# EAGLE design WT8266_universal_v01 (EAGLE 9.6.2)
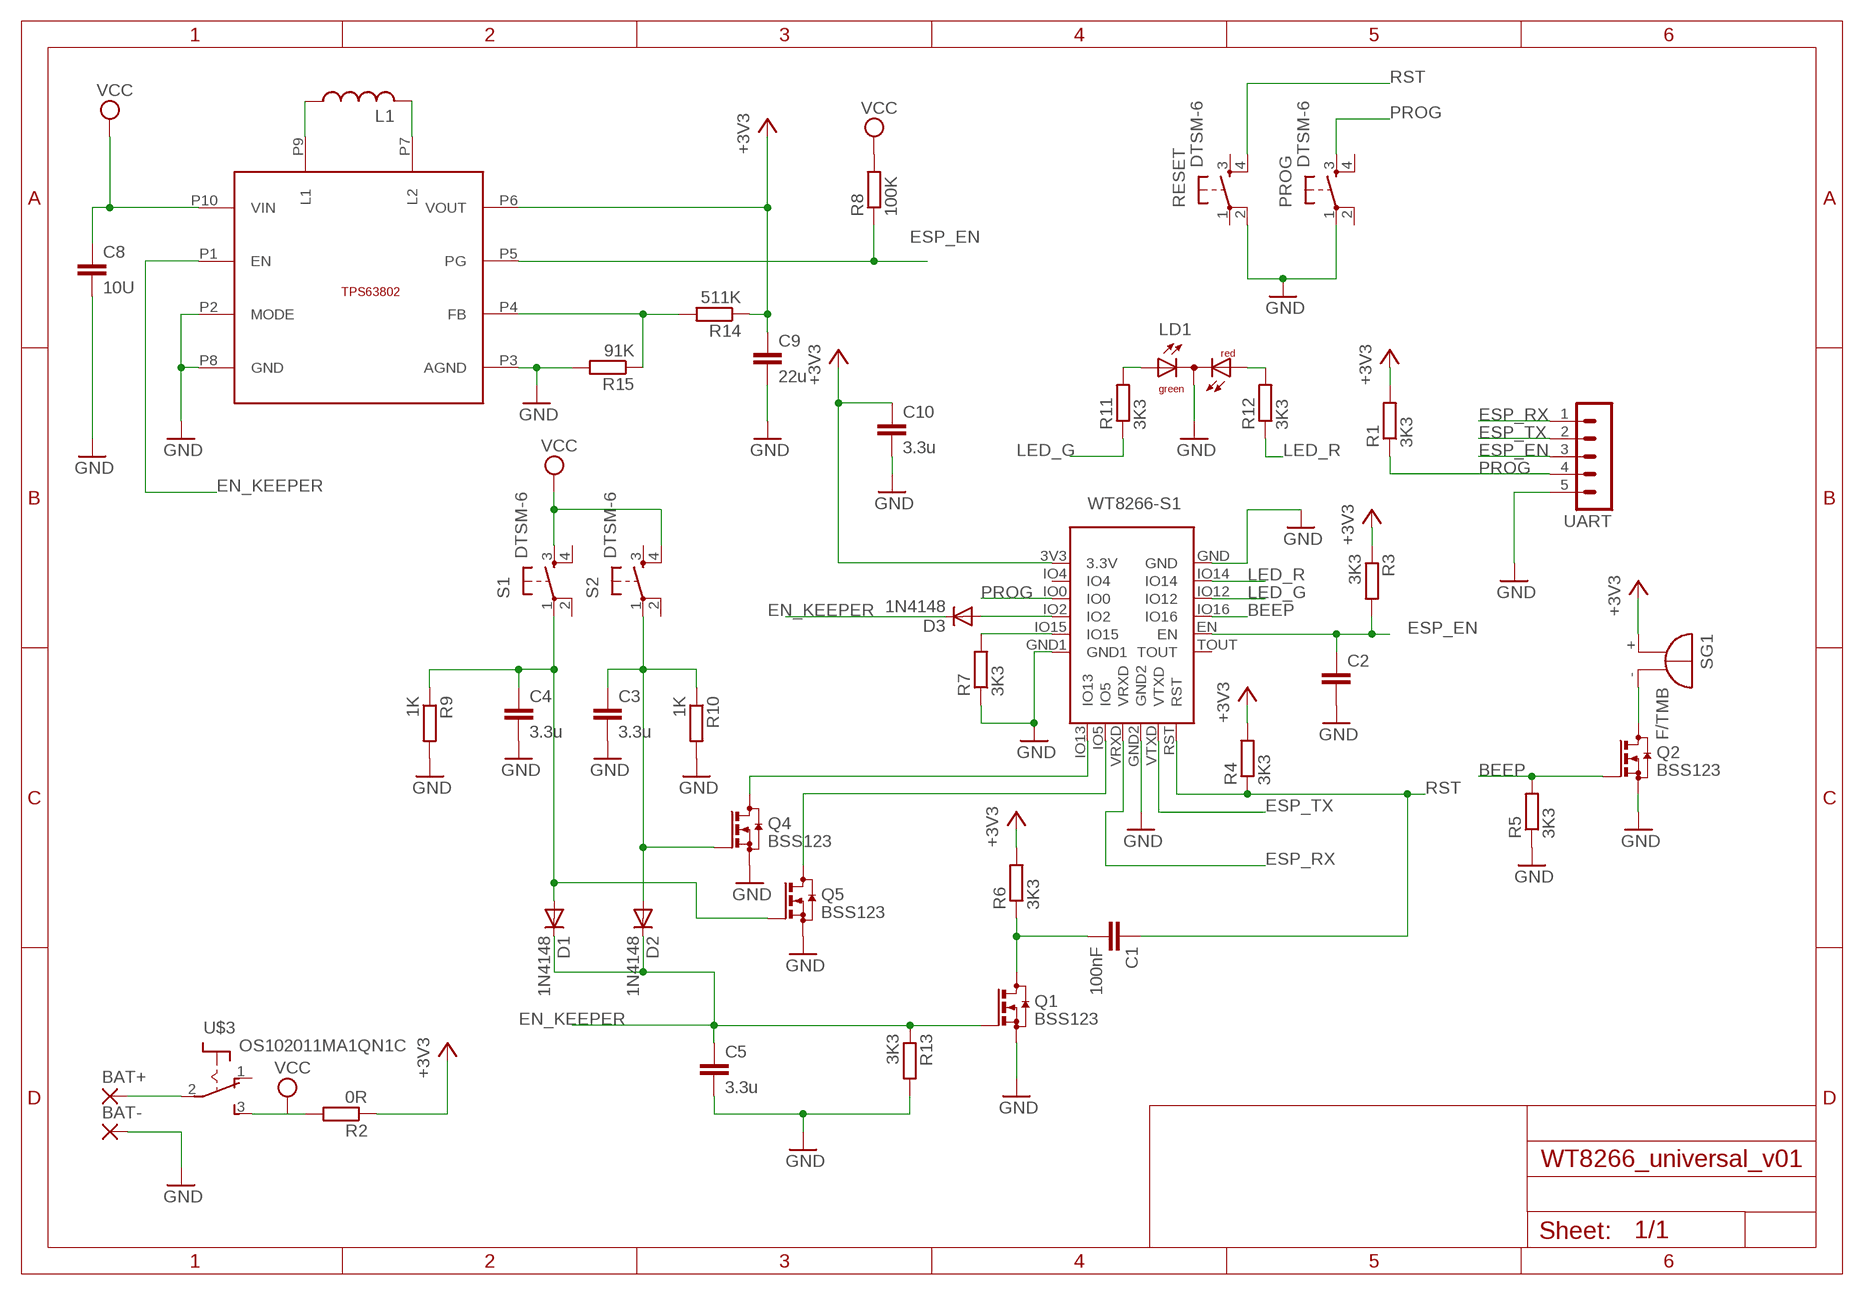
[diagram p0: schematic, sheet 1]

## Parts
BAT+  2,54/1,0  [2,54/1,0]
BAT-  2,54/1,0  [2,54/1,0]
C1  100nF  C-EUC0805  [C0805]
C2  C-EUC0805  [C0805]
C3  3.3u  C-EUC0805  [C0805]
C4  3.3u  C-EUC0805  [C0805]
C5  3.3u  C-EUC0805  [C0805]
C8  10U  C-EUC0805  [C0805]
C9  22u  C-EUC0805  [C0805]
C10  3.3u  C-EUC0805  [C0805]
D1  1N4148  [0805]
D2  1N4148  [0805]
D3  1N4148  [0805]
L1  L-USL2825P  [L2825P]
LD1  DUOLED-RG-C3MM  [DUOLED-A-3MM]
PROG  DTSM-6  [DTSM-6]
Q1  BSS123  [SOT23]
Q2  BSS123  [SOT23]
Q4  BSS123  [SOT23]
Q5  BSS123  [SOT23]
R1  3K3  R-EU_R0805  [R0805]
R2  0R  R-EU_R0805  [R0805]
R3  3K3  R-EU_R0805  [R0805]
R4  3K3  R-EU_R0805  [R0805]
R5  3K3  R-EU_R0805  [R0805]
R6  3K3  R-EU_R0805  [R0805]
R7  3K3  R-EU_R0805  [R0805]
R8  100K  R-EU_R0805  [R0805]
R9  1K  R-EU_R0805  [R0805]
R10  1K  R-EU_R0805  [R0805]
R11  3K3  R-EU_R0805  [R0805]
R12  3K3  R-EU_R0805  [R0805]
R13  3K3  R-EU_R0805  [R0805]
R14  511K  R-EU_R0805  [R0805]
R15  91K  R-EU_R0805  [R0805]
RESET  DTSM-6  [DTSM-6]
S1  DTSM-6  [DTSM-6]
S2  DTSM-6  [DTSM-6]
SG1  F/TMB  [F/TMB]
U$1  WT8266-S1  [WT8266-S1]
U$3  OS102011MA1QN1C  [OS102011MA1QN1C]
U$4  TPS63802  [VSON-HR-10]
UART  MAR05-1  [MAR05-1]

## Nets
+3V3: C9.1 C10.1 R1.2 R2.1 R3.1 R4.2 R6.2 R14.1 SG1.+ U$1.3V3(3.3V) U$4.P6(VOUT)
BEEP: Q2.1(G) R5.2 U$1.IO16
EN_KEEPER: C5.1 D1.1(C) D2.1(C) D3.1(C) Q1.1(G) R13.1 U$4.P1(EN)
ESP_EN: C2.1 R3.2 R8.1 U$1.EN U$4.P5(PG) UART.3
ESP_RX: U$1.VRXD UART.1
ESP_TX: U$1.VTXD UART.2
GND: BAT-.1(P) C2.2 C3.2 C4.2 C5.2 C8.2 C9.2 C10.2 LD1.2(C) PROG.1 Q1.2(S) Q2.2(S) Q4.2(S) Q5.2(S) R5.1 R7.1 R9.2 R10.2 R13.2 R15.2 RESET.2 U$1.GND U$1.GND1 U$1.GND2 U$4.P2(MODE) U$4.P3(AGND) U$4.P8(GND) UART.5
LED_G: R11.1 U$1.IO12
LED_R: R12.1 U$1.IO14
N$1: R14.2 R15.1 U$4.P4(FB)
N$2: C1.2 Q1.3(D) R6.1
N$3: R7.2 U$1.IO15
N$4: D3.2(A) U$1.IO2
N$5: Q4.3(D) U$1.IO13
N$6: Q5.3(D) U$1.IO5
N$7: LD1.1(AG) R11.2
N$8: Q2.3(D) SG1.-
N$9: BAT+.1(P) U$3.2(P)
N$10: C3.1 D2.2(A) Q4.1(G) R10.1 S2.1
N$11: L1.1 U$4.P9(L1)
N$12: C4.1 D1.2(A) Q5.1(G) R9.1 S1.1
N$13: L1.2 U$4.P7(L2)
N$14: LD1.3(AR) R12.2
PROG: PROG.3 R1.1 U$1.IO0 UART.4
RST: C1.1 R4.1 RESET.4 U$1.RST
VCC: C8.1 R2.2 R8.2 S1.3 S2.4 U$3.3(S) U$4.P10(VIN)
Unconnected: PROG.2 PROG.4 RESET.1 RESET.3 S1.2 S1.4 S2.2 S2.3 U$1.IO4 U$1.TOUT U$3.1(O)

## Library data of the parts
BAT+ BAT- = wirepad:2,54/1,0: THROUGH-HOLE PAD
C1-C5 C8-C10 = rcl:C-EU: CAPACITOR, European symbol
D1-D3 = diode:1N4148: DIODE high speed (Philips)
L1 = rcl:L-US: INDUCTOR, American symbol
LD1 = led:DUOLED-RG-C: DUO LED 2 colors (red/green), 5 mm, round, common Cathode www.ligitek.com or other producers.
PROG RESET S1 S2 = switch-tact:DTSM-6
Q1 Q2 Q4 Q5 = transistor-small-signal:BSS123: N-CHANNEL MOS FET
R1-R15 = rcl:R-EU_: RESISTOR, European symbol
SG1 = buzzer:F/TMB: BUZZER Source: Buerklin; OC_FARNELL: unknown; OC_NEWARK: unknown
U$1 = espressif:WT8266-S1
U$3 = switch:OS102011MA1QN1C
U$4 = texas:TPS63802
UART = con-lstb:MAR05-1: PIN HEADER; OC_FARNELL: unknown; OC_NEWARK: unknown

## Board
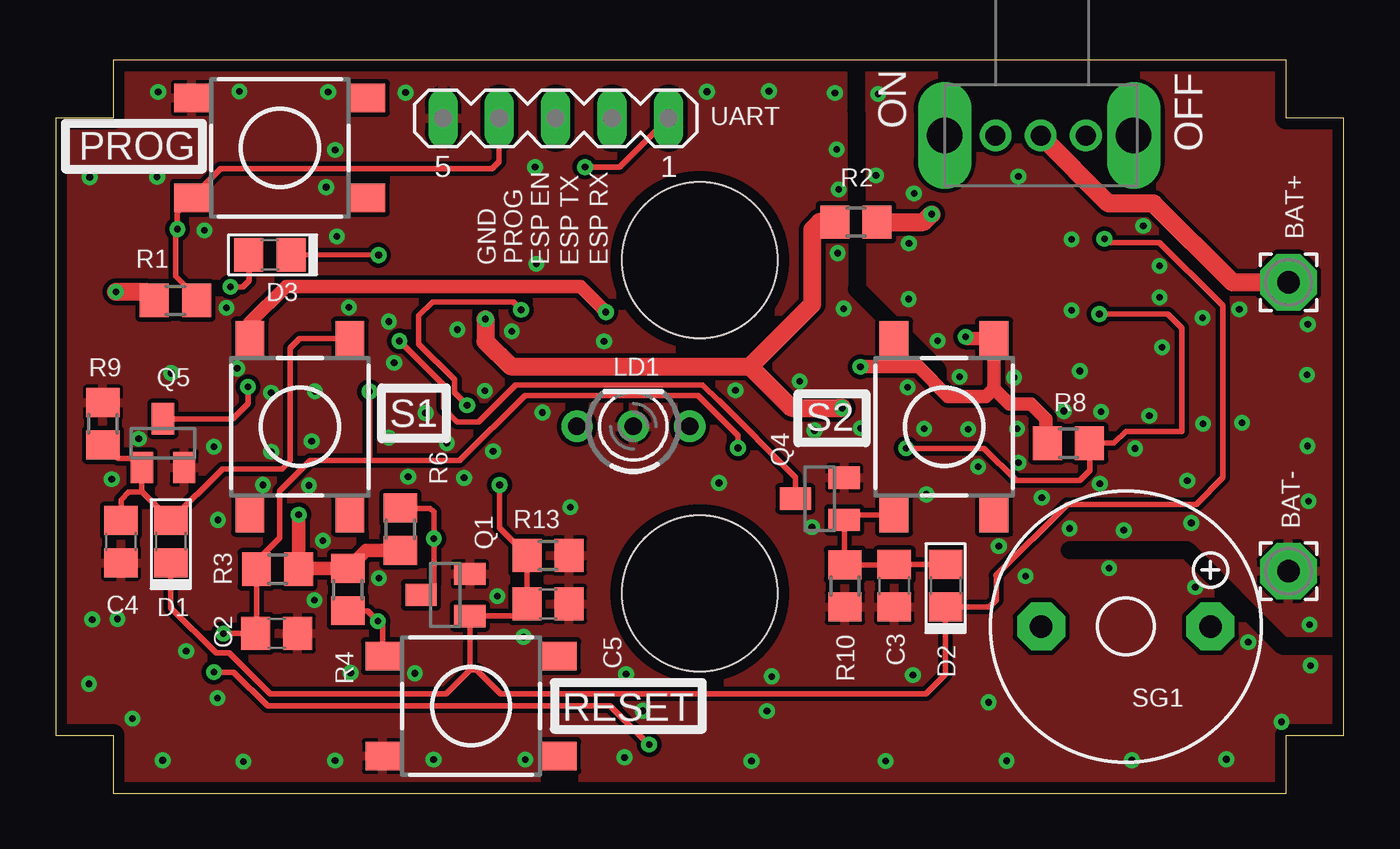
[diagram p1: board, top side]
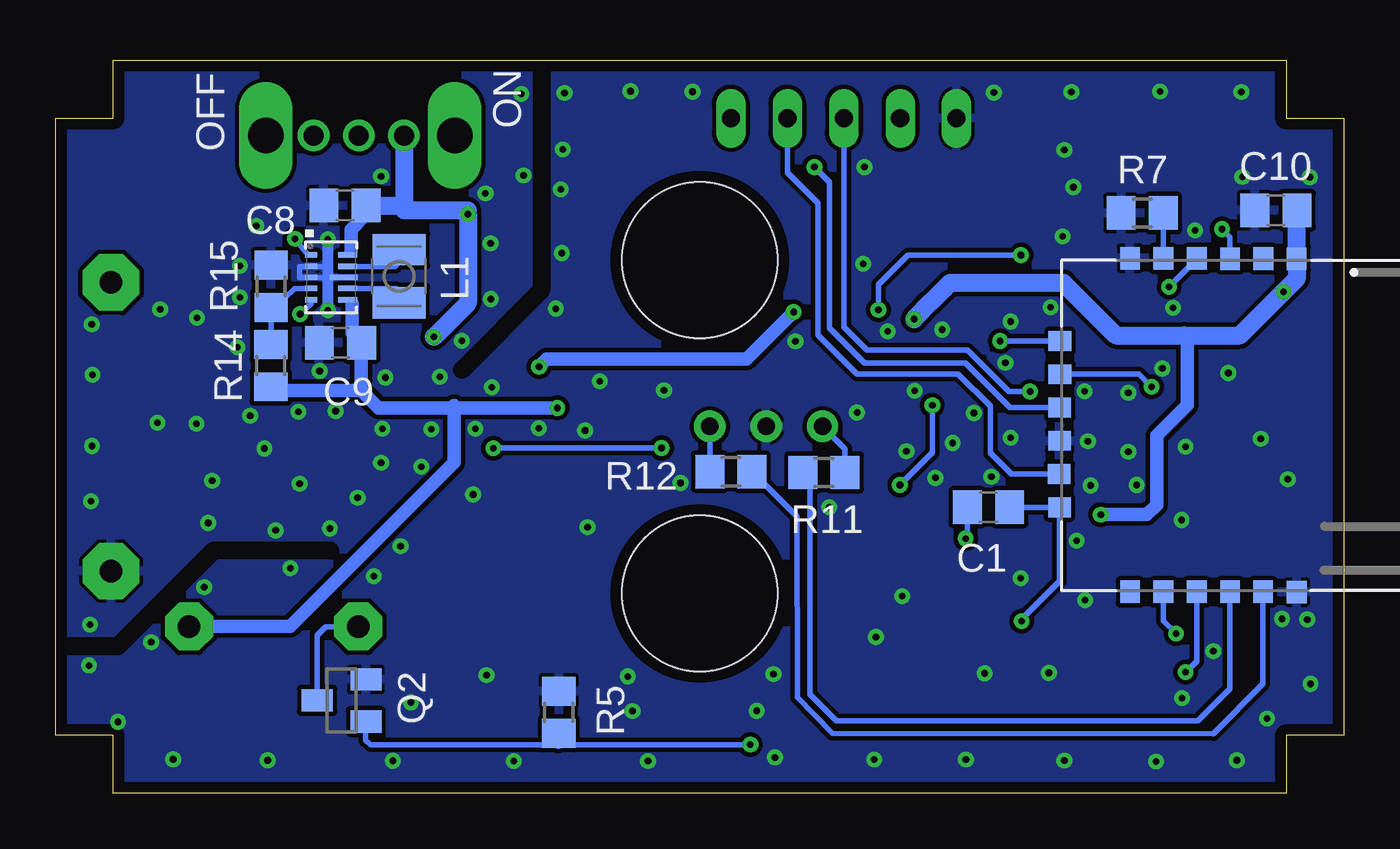
[diagram p2: board, bottom side, seen from below]

Size 58 x 33 mm. Coordinates in mm from the lower left corner, seen from the top.
Outline: 2.6,0 55.4,0 55.4,2.6 58,2.6 58,30.39 55.4,30.39 55.4,33 2.6,33 2.6,30.39 0,30.39 0,2.6 2.6,2.6 2.6,0
Copper layers (1*16): Top 0.035mm / dielectric 1.5mm / Bottom 0.035mm
Design rules "default *": minimum track width 6mil, minimum drill 0.3mm, track to track 6mil, track to pad 6mil, pad to pad 6mil, via to via 6mil, smd to smd 6mil, copper to edge 20mil, drill to drill 10mil, minimum pad ring 10mil, minimum via ring 8mil, stop-mask expansion 2mil, vias tented up to drill 12mil, thermal gap 6mil
Holes 7 mm at 29,9 29,24
tRestrict: 5 lines
bRestrict: 5 lines

### Footprints (pad centres in the part's own frame; a part is rotated, then mirrored left to right if it is on the bottom)
2,54/1,0 = drill 1.016 pad 2.54 octagon: 1 0,0
C0805 = smd 1.3 x 1.5: 1 -0.95,0; 2 0.95,0
0805 = smd 1.3 x 1.5: 1 -0.95,0; 2 0.95,0
L2825P = smd 1.4 x 2.4: 1 -1.2,0; 2 1.2,0
DUOLED-A-3MM = drill 0.8 pad 1.4: 1 -2.54,0; 2 0,0; 3 2.54,0
DTSM-6 = smd 1.55 x 1.3: 1 -3.975,2.25; 2 3.975,2.25; 3 -3.975,-2.25; 4 3.975,-2.25
SOT23 = smd 1 x 1.4: 1 -0.95,-1.1; 2 0.95,-1.1; 3 0,1.1
R0805 = smd 1.3 x 1.5: 1 -0.95,0; 2 0.95,0
F/TMB = drill 1.016 pad 2.159 octagon: + 3.81,0; - -3.81,0
WT8266-S1 = smd 1.016 x 0.889: 3V3 -7.62,1.753; EN 7.379,-4.248; GND 7.385,1.759; GND1 -7.639,-5.747; IO0 -7.62,-1.245; IO2 -7.633,-2.737; IO4 -7.626,0.26; IO12 7.379,-1.245; IO14 7.379,0.241; IO15 -7.633,-4.248; IO16 7.379,-2.743; TOUT 7.372,-5.74 | smd 0.889 x 1.016: GND2 0.578,-8.915; IO5 -2.419,-8.903; IO13 -3.918,-8.903; RST 3.581,-8.922; VRXD -0.921,-8.909; VTXD 2.076,-8.928
OS102011MA1QN1C = drill 0.9 pad 1.422: 1 -2.032,0; 2 0,0; 3 2.032,0 | drill 1.6 pad 2.184 long: P$1 -4.191,0; P$2 4.318,0
VSON-HR-10 = smd 0.6 x 0.25: P1 -0.902,1.003; P2 -0.902,0.495; P3 -0.902,0; P4 -0.902,-0.495; P5 -0.902,-1.003 | smd 0.9 x 0.25: P6 0.749,-1.003; P7 0.749,-0.495; P9 0.749,0.495; P10 0.749,1.003 | smd 1.3 x 0.25: P8 0.559,0
MAR05-1 = drill 0.813 long: 1 -5.08,0; 2 -2.54,0; 3 0,0; 4 2.54,0; 5 5.08,0

### Placement (x,y rotation side)
BAT+  55.5,23 0 top
BAT-  55.5,10 0 top
C1  16,12.88 180 bottom
C2  9.96,7.2 0 top
C3  37.76,9.35 270 top
C4  2.95,11.33 270 top
C5  22.17,8.52 0 top
C8  44.97,26.47 180 bottom
C9  45.17,20.28 180 bottom
C10  3.06,26.25 180 bottom
D1  5.19,11.33 90 top
D2  40.07,9.35 90 top
D3  9.65,24.24 180 top
L1  42.53,23.28 270 bottom
LD1  26.01,16.52 0 top
PROG  10.1,29.06 0 top
Q1  17.55,8.93 90 top
Q2  45.12,4.18 90 bottom
Q4  34.4,13.26 90 top
Q5  4.84,15.76 0 top
R1  5.4,22.19 180 top
R2  36.03,25.72 0 top
R3  9.99,10.08 180 top
R4  13.16,9.17 90 top
R5  35.34,3.64 270 bottom
R6  15.52,11.89 270 top
R7  9.08,26.12 0 bottom
R8  45.59,15.76 180 top
R9  2.13,16.64 90 top
R10  35.53,9.33 270 top
R11  23.41,14.44 0 bottom
R12  27.6,14.48 180 bottom
R13  22.17,10.71 0 top
R14  48.31,19.25 90 bottom
R15  48.3,22.82 90 bottom
RESET  18.71,3.92 180 top
S1  11,16.5 270 top
S2  40,16.5 90 top
SG1  48.18,7.51 0 top
U$1  3.89,16.45 270 bottom
U$3  44.35,29.62 180 top
U$4  45.59,23.23 0 bottom
UART  22.52,30.39 180 top

### Tracks (layer width: path | path; a pad name or v marks a point on that pad's centre or on a via)
+3V3  (via drill 0.3)
  Top 0.406: 35.23,17.55 v35.41,17.35
  Top 0.61: R6.2 13.97,10.94 R4.2 10.98,10.12 R3.1 v10.95,12.54 v10.95,12.55
  Top 0.813: v2.72,22.58 4.05,22.58 R1.2 | v19.36,21.35 19.36,20.34 20.5,19.21 31.27,19.21 | 31.27,19.21 33.13,17.35 v35.41,17.35 | R2.1 34.39,25.72 34.39,25.69 34.06,25.36 34.06,22.01 31.27,19.21
  Bottom 0.25: U$4.P6 44.68,22.23 44.65,22.05 | 44.23,20.27 C9.1
  Bottom 0.61: 44.65,22.05 44.65,20.71 C9.1 | 44.23,20.27 44.23,18.14 | 44.23,18.14 43.45,17.35 39.97,17.35 | R14.1 47.83,18.14 44.23,18.14 | v10.95,12.55 8.87,12.55 8.43,12.98 8.43,16.1 7.05,17.49 7.05,20.47 7.19,20.61 | SG1.+ 47.43,7.51 40.06,14.88 40.06,17.45 39.97,17.35 | v35.41,17.35 39.97,17.35
  Bottom 0.813: C10.1 2.13,26.23 U$1.3V3 2.13,23.16 v2.72,22.58 4.69,20.61 7.19,20.61 10.26,20.61 12.62,22.97 17.73,22.97 17.98,22.72 18,22.72 18.58,22.14 18.59,22.14 v19.36,21.35
BEEP  (via drill 0.3, 0.3 pad 0.3)
  Top 0.25: v26.72,2.18 24.97,3.94 9.54,3.94 8.03,5.45 v7.12,5.45
  Bottom 0.25: v26.72,2.18 35.37,2.18 43.83,2.18 44.03,2.39 Q2.1 | U$1.IO16 6.63,5.94 v7.12,5.45
  Bottom 0.406: R5.2 35.34,2.21 35.37,2.18
EN_KEEPER  (via drill 0.3)
  Top 0.25: D3.1 14.5,24.23 v14.54,24.23 | D1.1 5.19,8.34 7.23,6.31 7.81,6.31 9.66,4.47 17.58,4.47 18.66,5.55 | 18.66,5.55 Q1.1 20.68,7.98 C5.1 | v47.22,24.96 47.37,24.8 49.7,24.8 52.35,22.16 52.55,21.96 52.55,14.21 51.35,12.99 45.54,12.99 42.34,9.8 | 18.66,5.55 18.95,5.55 20.03,4.47 37.45,4.47 | v20.95,21.77 20.61,22.11 16.97,22.12 16.34,21.5 16.34,20.23 17.96,18.62 17.96,18.05 v18.53,17.48 | v19.99,13.88 19.99,11.94 R13.1
  Top 0.254: 37.45,4.47 39.19,4.47 40.07,5.35 D2.1 42.04,8.4 42.35,8.71 42.35,9.79 42.34,9.8 | C5.1 R13.1
  Bottom 0.25: v14.54,24.23 19.62,24.23 20.95,22.9 v20.95,21.77 | U$4.P1 46.63,24.23 v47.22,24.96 | v18.53,17.48 18.53,15.34 v19.99,13.88
ESP_EN  (via drill 0.3, 0.3 pad 0.3)
  Top 0.25: v46.99,21.58 50.08,21.58 50.71,20.94 50.71,16.29 48.17,16.29 47.64,15.76 R8.1 46.56,15.74 46.56,14.54 46.1,14.08 43.24,14.07 41.8,15.52 v38.29,15.53 | v7.56,7.19 8.99,7.19 C2.1 9.04,7.24 R3.2 9.04,10.46 10.08,11.49 10.08,13.6 11.46,14.97 14.03,14.97 | 30.71,15.56 v30.72,15.54 30.72,16.1 28.92,17.91 21.13,17.91 18.2,14.97 14.03,14.97 | v14.13,18.09 14.13,15.07 14.03,14.97
  Bottom 0.25: U$4.P5 46.49,22.04 v46.99,21.58 | U$1.EN 8.13,7.77 v7.56,7.19 | v38.29,15.53 38.28,15.54 v30.72,15.54 | 22.5,20.98 21.48,19.95 16.95,19.95 15.09,18.09 v14.13,18.09
  Bottom 0.254: 22.5,20.98 22.5,30.38 UART.3
ESP_RX  (via drill 0.3)
  Top 0.25: v23.84,28.19 25.4,28.19
  Top 0.254: 25.4,28.19 UART.1
  Bottom 0.25: U$1.VRXD 15.04,17.37 17.04,19.37 21.59,19.37 23.16,20.94 23.16,27.52 v23.84,28.19
ESP_TX
  Bottom 0.25: U$1.VTXD 14.97,14.37 15.93,15.33 15.93,17.42 17.37,18.87 21.92,18.87 23.69,20.64 23.69,26.57 25.06,27.94 25.06,30.37
  Bottom 0.254: 25.06,30.37 UART.2
GND  (via drill 0.3 pad 0.3)
  Bottom 0.25: U$4.P8 47,23.23 47,23.72 U$4.P2 45.74,23.72 45.74,23.28
  Bottom 0.5: v45.74,24.94 45.74,23.28 45.74,21.75
  other vias: 45.75,21.74 7.29,4.28 5.88,6.4 38.65,27.01 38.42,24.75 38.4,22.25 43.15,18.72 45.39,17.21 49.24,16.99 49.81,20.08 49.7,23.75 48.97,25.54 43.35,27.77 49.7,22.33 39.71,20.37 40.7,18.76 47.07,17.17 43.28,16.41 46.11,19.01 3.75,15.96 2.53,14.14 7.12,15.6 7.32,12.31 6.71,25.35 7.7,21.86 5.21,18.92 1.54,27.74 11.66,8.7 13.28,5.42 16.18,5.4 14.55,9.68 12.04,11.37 45.66,11.93 47.02,13.93 50.95,14.07 48.6,15.52 51.64,21.41 51.66,16.64 53.29,21.79 53.42,16.69 51.13,12.17 56.45,7.59 56.4,13.14 56.36,15.63 56.34,18.85 56.38,21.11 37.03,31.48 36.93,27.81 13.21,21.88 15.01,21.23 15.24,19.38 9.7,18.03 8.18,19.13 4.57,27.75 2.78,7.85 1.65,7.82 1.5,4.93 3.47,3.37 4.83,1.49 8.46,1.42 12.59,1.47 17.02,1.51 21.15,1.51 25.62,1.61 4.62,31.57 8.28,31.6 12.27,31.57 15.76,31.55 29.32,31.58 32.12,31.61 35.09,31.53 35.17,28.99 35.26,27.19 35.22,24.32 35.48,21.82 38.37,18.28 31.33,1.45 37.38,1.45 42.81,1.46 48.45,1.49 52.7,1.52 55.19,3.21 56.49,5.75 53.7,6.81 51.31,9.28 47.43,10.13 48.09,11.84 43.68,9.78 42.47,11.13 44.4,13.31 43.35,14.88 41.08,16.38 39.1,16.41 29.87,13.97 34.05,11.98 39.2,13.45 30.61,18.15 33.5,18.54 26.44,3.71 25.68,5.36 32.25,5.26 32.03,3.7 38.6,5.32 42.01,4.09 41.53,14.71 36.25,16.43 34.16,16.33 23.18,12.88 21.92,17.14 24.69,20.35 18.08,20.88 19.89,8.88 21.07,7.04 15.01,16 16.66,17.12 11.67,18.1 11.53,15.85 9.7,15.38 11.4,13.86 9.33,13.88 17.61,15.77 19.33,18.12 19.7,15.41 18.39,14.2 15.88,14.25 20.54,20.8 21.64,23.84 12.66,25.07 12.18,27.29 12.59,28.97 21.59,28.19
  pour Top (isolate 0.2): -0.1,33.06 58.09,33.35 58.42,-0.06 -0.25,-0.22
  pour Bottom (isolate 0.2): -0.3,33.16 57.86,33.32 58.09,-0.08 0.32,-0.24
LED_G
  Bottom 0.25: U$1.IO12 5.13,4.7 6.58,3.25 22.85,3.25 24.04,4.45 24.04,14.12 R11.1
LED_R
  Bottom 0.25: U$1.IO14 3.65,4.92 5.88,2.68 23.04,2.71 24.61,4.32 24.62,12.47 R12.1
N$1
  Bottom 0.25: U$4.P4 47.24,22.73 47.68,22.3 47.87,22.3 R15.1 48.3,20.22 R14.2
N$2  (via drill 0.3)
  Top 0.25: R6.1 15.53,12.83 16.87,12.83 17.03,12.66 v17.03,11.47 17.03,9.42 Q1.3
  Bottom 0.25: C1.2 16.95,11.57 v17.03,11.47
N$3
  Bottom 0.25: U$1.IO15 R7.2
N$4  (via drill 0.3)
  Top 0.25: v7.87,22.8 8.42,22.8 8.71,23.09 8.71,24.23 D3.2
  Bottom 0.25: U$1.IO2 6.62,24.05 v7.87,22.8
N$5  (via drill 0.3)
  Top 0.25: v15.48,20.36 17.46,18.38 17.46,17.35 18.09,16.73 19.05,16.73 20.71,18.39 29.13,18.39 29.84,17.68 29.86,17.68 33.31,14.22 33.31,13.27 Q4.3
  Bottom 0.25: v15.48,20.36 U$1.IO13
N$6  (via drill 0.3)
  Top 0.25: v8.66,18.3 8.66,17.55 7.96,16.85 6.85,16.85 | Q5.3 6.8,16.86
  Top 0.254: 6.85,16.85 6.81,16.85 6.8,16.86
  Bottom 0.25: U$1.IO5 9.23,18.87 v8.66,18.3
N$7
  Bottom 0.25: R11.2 22.46,15.51 LD1.1
N$8
  Bottom 0.25: Q2.3 46.22,7.12 45.85,7.49 44.39,7.49 SG1.-
N$9
  Top 0.813: BAT+.1 53,23 49.43,26.56 47.4,26.56 U$3.2
N$10
  Top 0.25: S2.1 35.72,12.53 Q4.1 35.5,10.31 R10.1
  Top 0.254: R10.1 37.74,10.28 C3.1 D2.2
N$11
  Bottom 0.25: U$4.P9 42.72,23.72 42.53,23.91 L1.1
N$12
  Top 0.25: C4.1 2.95,13.21 3.3,13.56 3.82,13.56 3.89,13.63 | 3.89,13.63 Q5.1 3.47,15.07 2.83,15.07 2.22,15.69 R9.1 | S1.1 10.99,20.48 10.55,20.04 10.55,14.97 10.2,14.61 7.53,14.61 D1.2 3.89,13.59 3.89,13.63
N$13
  Bottom 0.25: U$4.P7 42.66,22.73 42.53,22.61 L1.2
N$14
  Bottom 0.25: LD1.3 R12.2
PROG  (via drill 0.3)
  Top 0.25: R1.1 6.35,22.36 5.41,23.29 5.41,25.32 v5.49,25.4 5.49,26.17 PROG.3 7.43,28.12 19.65,28.12 19.96,28.43
  Top 0.254: 19.96,28.43 19.96,30.38 UART.4
  Bottom 0.25: U$1.IO0 5.13,25.04 v5.49,25.4
RST  (via drill 0.3)
  Top 0.25: R4.1 14.04,8.22 v14.52,7.75 14.73,7.53 RESET.4
  Bottom 0.25: C1.1 15.04,12.87 U$1.RST 12.8,9.54 14.52,7.82 v14.52,7.75
VCC  (via drill 0.3, 0.3 pad 0.3)
  Top 0.25: 44.59,15.81 R8.2
  Top 0.61: v40.97,20.55 41.04,20.48 S2.4 42.25,18.21 | 42.25,18.21 42.94,17.53 43.92,17.53 44.59,16.85 44.59,15.81 | S1.3 8.75,21.18 10.38,22.81 23.64,22.81 v24.78,21.67 | v36.23,19.2 38.84,19.2 40.18,17.86 41.89,17.86 42.25,18.21
  Top 0.813: R2.2 39.08,25.72 v39.43,26.07
  Bottom 0.25: 44.7,24.41 U$4.P10
  Bottom 0.61: 42.32,26.26 42.29,26.25 | C8.1 44.07,26.02 44.7,25.39 44.7,24.41 | v24.78,21.67 26.9,19.55 35.89,19.55 v36.23,19.2
  Bottom 0.813: U$3.3 42.32,26.26 | 42.29,26.25 42.15,26.25 | 42.15,26.25 39.43,26.25 v39.43,26.07 39.43,22.07 v40.97,20.55 | C8.1 42.37,26.47 42.15,26.25

### Text on the board
tNames: ON | OFF | GND | PROG | ESP EN | ESP TX | ESP RX
bNames: ON | OFF